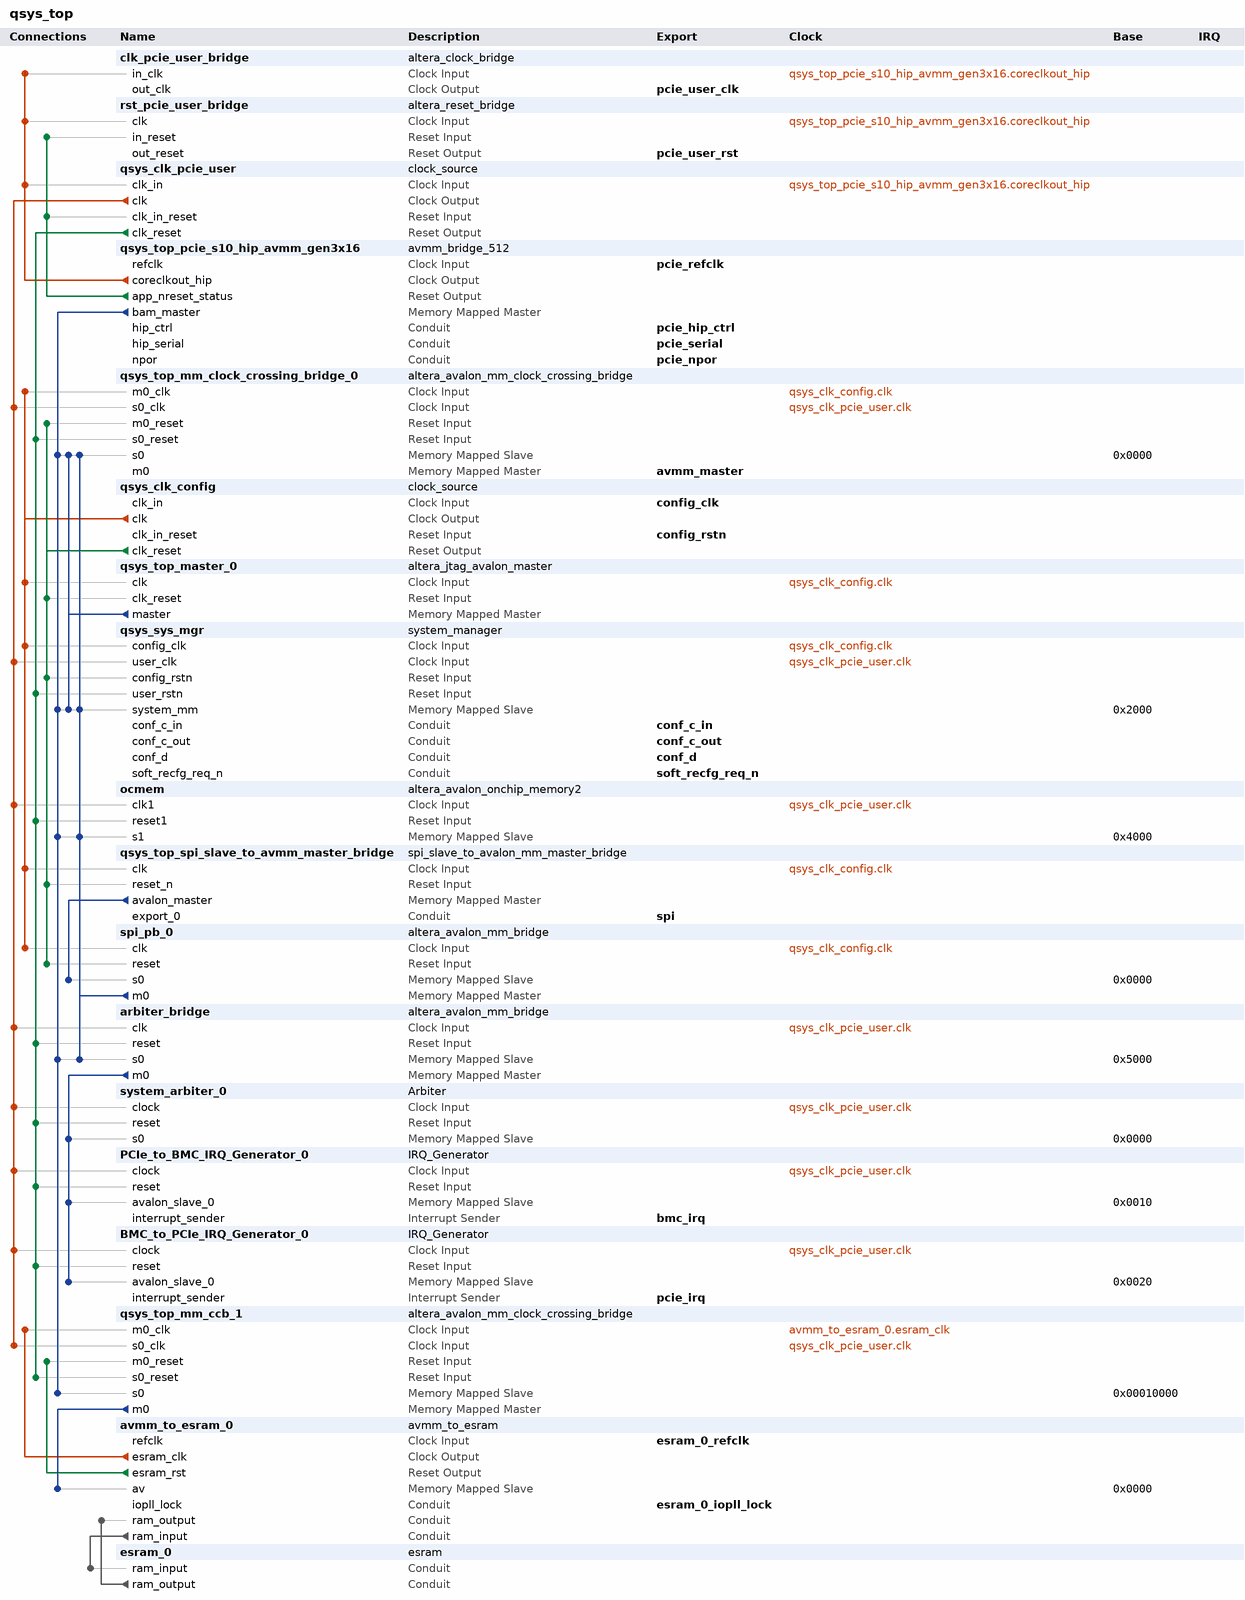
[diagram p0: system contents]
# Platform Designer (Qsys) system qsys_top, Stratix 10 1SM21CHU2F53E2VG
# Parameters at their usual value, and those the tool derives, are not listed.
package require -exact qsys 1.0
create_system qsys_top
set_project_property DEVICE_FAMILY {Stratix 10}
set_project_property DEVICE 1SM21CHU2F53E2VG

add_component clk_pcie_user_bridge ip/qsys_top/qsys_top_clock_bridge_0.ip altera_clock_bridge clk_pcie_user_bridge 19.2.0
load_component clk_pcie_user_bridge
set_component_parameter_value DERIVED_CLOCK_RATE 125000000
set_component_parameter_value EXPLICIT_CLOCK_RATE 250000000
save_component

add_component rst_pcie_user_bridge ip/qsys_top/rst_pcie_user_bridge.ip altera_reset_bridge rst_pcie_user_bridge 19.2.0
load_component rst_pcie_user_bridge
set_component_parameter_value ACTIVE_LOW_RESET 0
set_component_parameter_value SYNCHRONOUS_EDGES deassert
set_component_parameter_value SYNC_RESET 0
save_component

add_component qsys_clk_pcie_user ip/qsys_top/qsys_top_clk_0.ip clock_source qsys_clk_pcie_user 
load_component qsys_clk_pcie_user
set_component_parameter_value clockFrequency 250000000
save_component

add_component qsys_top_pcie_s10_hip_avmm_gen3x16 ip/qsys_top/qsys_top_avmm_bridge_512_0.ip avmm_bridge_512 qsys_top_pcie_s10_hip_avmm_gen3x16 21.0.0
load_component qsys_top_pcie_s10_hip_avmm_gen3x16
set_component_parameter_value interface_type_hwtcl Avalon-MM
set_component_parameter_value interface_type_integer_hwtcl 1
set_component_parameter_value device_die_types HSSI_CRETE2E,MAIN_ND4H,UIB_HBM
set_component_parameter_value device_die_revisions HSSI_CRETE2E_REVB,MAIN_ND4H_REVB,UIB_HBM_REVB
set_component_parameter_value crete_type 3
set_component_parameter_value app_interface_width_hwtcl 512-bit
set_component_parameter_value wrala_hwtcl {Gen3x16, Interface - 512 bit, 250 MHz}
set_component_parameter_value wrala_integer_hwtcl 1
set_component_parameter_value select_design_example_hwtcl PIO
set_component_parameter_value virtual_rp_ep_mode_hwtcl {Native Endpoint}
set_component_parameter_value virtual_rp_ep_mode_integer_hwtcl 0
set_component_parameter_value virtual_ep_native_hwtcl Native
set_component_parameter_value virtual_link_width_hwtcl x16
set_component_parameter_value virtual_link_width_integer_hwtcl 16
set_component_parameter_value virtual_link_rate_hwtcl {Gen3 (8.0 Gbps)}
set_component_parameter_value virtual_link_rate_integer_hwtcl 3
set_component_parameter_value virtual_txeq_mode_hwtcl gen3_cr2
set_component_parameter_value enable_512adapter_hwtcl 1
set_component_parameter_value enable_pcie_cv_fix 0
set_component_parameter_value enable_rx_buffer_limit_ports_hwtcl 1
set_component_parameter_value rx_np_buffer_limit_bypass_hwtcl 0
set_component_parameter_value rx_p_buffer_limit_bypass_hwtcl 0
set_component_parameter_value rx_cpl_buffer_limit_bypass_hwtcl 0
set_component_parameter_value en_order_rx_posted_cpl_hwtcl 1
set_component_parameter_value enable_multi_func_hwtcl 0
set_component_parameter_value total_pf_count_hwtcl 1
set_component_parameter_value user_total_pf_count_hwtcl 1
set_component_parameter_value total_pf_count_width_hwtcl 1
set_component_parameter_value virtual_pf1_enable_hwtcl 0
set_component_parameter_value virtual_pf2_enable_hwtcl 0
set_component_parameter_value virtual_pf3_enable_hwtcl 0
set_component_parameter_value enable_sriov_hwtcl 0
set_component_parameter_value virtual_pf1_sriov_enable_hwtcl 0
set_component_parameter_value virtual_pf2_sriov_enable_hwtcl 0
set_component_parameter_value virtual_pf3_sriov_enable_hwtcl 0
set_component_parameter_value pf0_vf_count_hwtcl 0
set_component_parameter_value pf0_sriov_sup_page_size_hwtcl 0KB
set_component_parameter_value pf0_loopback_enable_hwtcl 0
set_component_parameter_value pf1_vf_count_hwtcl 0
set_component_parameter_value pf1_sriov_sup_page_size_hwtcl 0KB
set_component_parameter_value pf2_vf_count_hwtcl 0
set_component_parameter_value pf2_sriov_sup_page_size_hwtcl 0KB
set_component_parameter_value pf3_vf_count_hwtcl 0
set_component_parameter_value pf3_sriov_sup_page_size_hwtcl 0KB
set_component_parameter_value total_vf_count_hwtcl 0
set_component_parameter_value total_vf_count_width_hwtcl 1
set_component_parameter_value pf0_bar0_type_user_hwtcl {64-bit prefetchable memory}
set_component_parameter_value pf0_bar0_address_width_user_hwtcl 20
set_component_parameter_value pf0_bar0_type_hwtcl {64-bit prefetchable memory}
set_component_parameter_value pf0_bar0_type_integer_hwtcl 1
set_component_parameter_value pf0_bar0_address_width_hwtcl 20
set_component_parameter_value pf0_bar1_type_user_hwtcl Disabled
set_component_parameter_value pf0_bar1_address_width_user_hwtcl 0
set_component_parameter_value pf0_bar1_type_hwtcl Disabled
set_component_parameter_value pf0_bar1_type_integer_hwtcl 0
set_component_parameter_value pf0_bar1_address_width_hwtcl 0
set_component_parameter_value pf0_bar2_type_user_hwtcl Disabled
set_component_parameter_value pf0_bar2_address_width_user_hwtcl 0
set_component_parameter_value pf0_bar2_type_hwtcl Disabled
set_component_parameter_value pf0_bar2_type_integer_hwtcl 0
set_component_parameter_value pf0_bar2_address_width_hwtcl 0
set_component_parameter_value pf0_bar3_type_user_hwtcl Disabled
set_component_parameter_value pf0_bar3_address_width_user_hwtcl 0
set_component_parameter_value pf0_bar3_type_hwtcl Disabled
set_component_parameter_value pf0_bar3_type_integer_hwtcl 0
set_component_parameter_value pf0_bar3_address_width_hwtcl 0
set_component_parameter_value pf0_bar4_type_user_hwtcl Disabled
set_component_parameter_value pf0_bar4_address_width_user_hwtcl 0
set_component_parameter_value pf0_bar4_type_hwtcl Disabled
set_component_parameter_value pf0_bar4_type_integer_hwtcl 0
set_component_parameter_value pf0_bar4_address_width_hwtcl 0
set_component_parameter_value pf0_bar5_type_user_hwtcl Disabled
set_component_parameter_value pf0_bar5_address_width_user_hwtcl 0
set_component_parameter_value pf0_bar5_type_hwtcl Disabled
set_component_parameter_value pf0_bar5_type_integer_hwtcl 0
set_component_parameter_value pf0_bar5_address_width_hwtcl 0
set_component_parameter_value pf0_rom_bar_enabled_hwtcl disable
set_component_parameter_value pf0_expansion_base_address_register_hwtcl 0
set_component_parameter_value pf0_sriov_vf_bar0_type_hwtcl Disabled
set_component_parameter_value pf0_sriov_vf_bar0_type_integer_hwtcl 0
set_component_parameter_value pf0_sriov_vf_bar0_address_width_hwtcl 0
set_component_parameter_value pf0_sriov_vf_bar1_type_hwtcl Disabled
set_component_parameter_value pf0_sriov_vf_bar1_type_integer_hwtcl 0
set_component_parameter_value pf0_sriov_vf_bar1_address_width_hwtcl 0
set_component_parameter_value pf0_sriov_vf_bar2_type_hwtcl Disabled
set_component_parameter_value pf0_sriov_vf_bar2_type_integer_hwtcl 0
set_component_parameter_value pf0_sriov_vf_bar2_address_width_hwtcl 0
set_component_parameter_value pf0_sriov_vf_bar3_type_hwtcl Disabled
set_component_parameter_value pf0_sriov_vf_bar3_type_integer_hwtcl 0
set_component_parameter_value pf0_sriov_vf_bar3_address_width_hwtcl 0
set_component_parameter_value pf0_sriov_vf_bar4_type_hwtcl Disabled
set_component_parameter_value pf0_sriov_vf_bar4_type_integer_hwtcl 0
set_component_parameter_value pf0_sriov_vf_bar4_address_width_hwtcl 0
set_component_parameter_value pf0_sriov_vf_bar5_type_hwtcl Disabled
set_component_parameter_value pf0_sriov_vf_bar5_type_integer_hwtcl 0
set_component_parameter_value pf0_sriov_vf_bar5_address_width_hwtcl 0
set_component_parameter_value pf1_bar0_type_user_hwtcl Disabled
set_component_parameter_value pf1_bar0_address_width_user_hwtcl 0
set_component_parameter_value pf1_bar0_type_hwtcl Disabled
set_component_parameter_value pf1_bar0_type_integer_hwtcl 0
set_component_parameter_value pf1_bar0_address_width_hwtcl 0
set_component_parameter_value pf1_bar1_type_user_hwtcl Disabled
set_component_parameter_value pf1_bar1_address_width_user_hwtcl 0
set_component_parameter_value pf1_bar1_type_hwtcl Disabled
set_component_parameter_value pf1_bar1_type_integer_hwtcl 0
set_component_parameter_value pf1_bar1_address_width_hwtcl 0
set_component_parameter_value pf1_bar2_type_user_hwtcl Disabled
set_component_parameter_value pf1_bar2_address_width_user_hwtcl 0
set_component_parameter_value pf1_bar2_type_hwtcl Disabled
set_component_parameter_value pf1_bar2_type_integer_hwtcl 0
set_component_parameter_value pf1_bar2_address_width_hwtcl 0
set_component_parameter_value pf1_bar3_type_user_hwtcl Disabled
set_component_parameter_value pf1_bar3_address_width_user_hwtcl 0
set_component_parameter_value pf1_bar3_type_hwtcl Disabled
set_component_parameter_value pf1_bar3_type_integer_hwtcl 0
set_component_parameter_value pf1_bar3_address_width_hwtcl 0
set_component_parameter_value pf1_bar4_type_user_hwtcl Disabled
set_component_parameter_value pf1_bar4_address_width_user_hwtcl 0
set_component_parameter_value pf1_bar4_type_hwtcl Disabled
set_component_parameter_value pf1_bar4_type_integer_hwtcl 0
set_component_parameter_value pf1_bar4_address_width_hwtcl 0
set_component_parameter_value pf1_bar5_type_user_hwtcl Disabled
set_component_parameter_value pf1_bar5_address_width_user_hwtcl 0
set_component_parameter_value pf1_bar5_type_hwtcl Disabled
set_component_parameter_value pf1_bar5_type_integer_hwtcl 0
set_component_parameter_value pf1_bar5_address_width_hwtcl 0
set_component_parameter_value pf1_rom_bar_enabled_hwtcl disable
set_component_parameter_value pf1_expansion_base_address_register_hwtcl 0
set_component_parameter_value pf1_sriov_vf_bar0_type_hwtcl Disabled
set_component_parameter_value pf1_sriov_vf_bar0_type_integer_hwtcl 0
set_component_parameter_value pf1_sriov_vf_bar0_address_width_hwtcl 0
set_component_parameter_value pf1_sriov_vf_bar1_type_hwtcl Disabled
set_component_parameter_value pf1_sriov_vf_bar1_type_integer_hwtcl 0
set_component_parameter_value pf1_sriov_vf_bar1_address_width_hwtcl 0
set_component_parameter_value pf1_sriov_vf_bar2_type_hwtcl Disabled
set_component_parameter_value pf1_sriov_vf_bar2_type_integer_hwtcl 0
set_component_parameter_value pf1_sriov_vf_bar2_address_width_hwtcl 0
set_component_parameter_value pf1_sriov_vf_bar3_type_hwtcl Disabled
set_component_parameter_value pf1_sriov_vf_bar3_type_integer_hwtcl 0
set_component_parameter_value pf1_sriov_vf_bar3_address_width_hwtcl 0
set_component_parameter_value pf1_sriov_vf_bar4_type_hwtcl Disabled
set_component_parameter_value pf1_sriov_vf_bar4_type_integer_hwtcl 0
set_component_parameter_value pf1_sriov_vf_bar4_address_width_hwtcl 0
set_component_parameter_value pf1_sriov_vf_bar5_type_hwtcl Disabled
set_component_parameter_value pf1_sriov_vf_bar5_type_integer_hwtcl 0
set_component_parameter_value pf1_sriov_vf_bar5_address_width_hwtcl 0
set_component_parameter_value pf2_bar0_type_user_hwtcl Disabled
set_component_parameter_value pf2_bar0_address_width_user_hwtcl 0
set_component_parameter_value pf2_bar0_type_hwtcl Disabled
set_component_parameter_value pf2_bar0_type_integer_hwtcl 0
set_component_parameter_value pf2_bar0_address_width_hwtcl 0
set_component_parameter_value pf2_bar1_type_user_hwtcl Disabled
set_component_parameter_value pf2_bar1_address_width_user_hwtcl 0
set_component_parameter_value pf2_bar1_type_hwtcl Disabled
set_component_parameter_value pf2_bar1_type_integer_hwtcl 0
set_component_parameter_value pf2_bar1_address_width_hwtcl 0
set_component_parameter_value pf2_bar2_type_user_hwtcl Disabled
set_component_parameter_value pf2_bar2_address_width_user_hwtcl 0
set_component_parameter_value pf2_bar2_type_hwtcl Disabled
set_component_parameter_value pf2_bar2_type_integer_hwtcl 0
set_component_parameter_value pf2_bar2_address_width_hwtcl 0
set_component_parameter_value pf2_bar3_type_user_hwtcl Disabled
set_component_parameter_value pf2_bar3_address_width_user_hwtcl 0
set_component_parameter_value pf2_bar3_type_hwtcl Disabled
set_component_parameter_value pf2_bar3_type_integer_hwtcl 0
set_component_parameter_value pf2_bar3_address_width_hwtcl 0
set_component_parameter_value pf2_bar4_type_user_hwtcl Disabled
set_component_parameter_value pf2_bar4_address_width_user_hwtcl 0
set_component_parameter_value pf2_bar4_type_hwtcl Disabled
set_component_parameter_value pf2_bar4_type_integer_hwtcl 0
set_component_parameter_value pf2_bar4_address_width_hwtcl 0
set_component_parameter_value pf2_bar5_type_user_hwtcl Disabled
set_component_parameter_value pf2_bar5_address_width_user_hwtcl 0
set_component_parameter_value pf2_bar5_type_hwtcl Disabled
set_component_parameter_value pf2_bar5_type_integer_hwtcl 0
set_component_parameter_value pf2_bar5_address_width_hwtcl 0
set_component_parameter_value pf2_rom_bar_enabled_hwtcl disable
set_component_parameter_value pf2_expansion_base_address_register_hwtcl 0
set_component_parameter_value pf2_sriov_vf_bar0_type_hwtcl Disabled
set_component_parameter_value pf2_sriov_vf_bar0_type_integer_hwtcl 0
set_component_parameter_value pf2_sriov_vf_bar0_address_width_hwtcl 0
set_component_parameter_value pf2_sriov_vf_bar1_type_hwtcl Disabled
set_component_parameter_value pf2_sriov_vf_bar1_type_integer_hwtcl 0
set_component_parameter_value pf2_sriov_vf_bar1_address_width_hwtcl 0
set_component_parameter_value pf2_sriov_vf_bar2_type_hwtcl Disabled
set_component_parameter_value pf2_sriov_vf_bar2_type_integer_hwtcl 0
set_component_parameter_value pf2_sriov_vf_bar2_address_width_hwtcl 0
set_component_parameter_value pf2_sriov_vf_bar3_type_hwtcl Disabled
set_component_parameter_value pf2_sriov_vf_bar3_type_integer_hwtcl 0
set_component_parameter_value pf2_sriov_vf_bar3_address_width_hwtcl 0
set_component_parameter_value pf2_sriov_vf_bar4_type_hwtcl Disabled
set_component_parameter_value pf2_sriov_vf_bar4_type_integer_hwtcl 0
set_component_parameter_value pf2_sriov_vf_bar4_address_width_hwtcl 0
set_component_parameter_value pf2_sriov_vf_bar5_type_hwtcl Disabled
set_component_parameter_value pf2_sriov_vf_bar5_type_integer_hwtcl 0
set_component_parameter_value pf2_sriov_vf_bar5_address_width_hwtcl 0
set_component_parameter_value pf3_bar0_type_user_hwtcl Disabled
set_component_parameter_value pf3_bar0_address_width_user_hwtcl 0
set_component_parameter_value pf3_bar0_type_hwtcl Disabled
set_component_parameter_value pf3_bar0_type_integer_hwtcl 0
set_component_parameter_value pf3_bar0_address_width_hwtcl 0
set_component_parameter_value pf3_bar1_type_user_hwtcl Disabled
set_component_parameter_value pf3_bar1_address_width_user_hwtcl 0
set_component_parameter_value pf3_bar1_type_hwtcl Disabled
set_component_parameter_value pf3_bar1_type_integer_hwtcl 0
set_component_parameter_value pf3_bar1_address_width_hwtcl 0
set_component_parameter_value pf3_bar2_type_user_hwtcl Disabled
set_component_parameter_value pf3_bar2_address_width_user_hwtcl 0
set_component_parameter_value pf3_bar2_type_hwtcl Disabled
set_component_parameter_value pf3_bar2_type_integer_hwtcl 0
set_component_parameter_value pf3_bar2_address_width_hwtcl 0
set_component_parameter_value pf3_bar3_type_user_hwtcl Disabled
set_component_parameter_value pf3_bar3_address_width_user_hwtcl 0
set_component_parameter_value pf3_bar3_type_hwtcl Disabled
set_component_parameter_value pf3_bar3_type_integer_hwtcl 0
set_component_parameter_value pf3_bar3_address_width_hwtcl 0
set_component_parameter_value pf3_bar4_type_user_hwtcl Disabled
set_component_parameter_value pf3_bar4_address_width_user_hwtcl 0
set_component_parameter_value pf3_bar4_type_hwtcl Disabled
set_component_parameter_value pf3_bar4_type_integer_hwtcl 0
set_component_parameter_value pf3_bar4_address_width_hwtcl 0
set_component_parameter_value pf3_bar5_type_user_hwtcl Disabled
set_component_parameter_value pf3_bar5_address_width_user_hwtcl 0
set_component_parameter_value pf3_bar5_type_hwtcl Disabled
set_component_parameter_value pf3_bar5_type_integer_hwtcl 0
set_component_parameter_value pf3_bar5_address_width_hwtcl 0
set_component_parameter_value pf3_rom_bar_enabled_hwtcl disable
set_component_parameter_value pf3_expansion_base_address_register_hwtcl 0
set_component_parameter_value pf3_sriov_vf_bar0_type_hwtcl Disabled
set_component_parameter_value pf3_sriov_vf_bar0_type_integer_hwtcl 0
set_component_parameter_value pf3_sriov_vf_bar0_address_width_hwtcl 0
set_component_parameter_value pf3_sriov_vf_bar1_type_hwtcl Disabled
set_component_parameter_value pf3_sriov_vf_bar1_type_integer_hwtcl 0
set_component_parameter_value pf3_sriov_vf_bar1_address_width_hwtcl 0
set_component_parameter_value pf3_sriov_vf_bar2_type_hwtcl Disabled
set_component_parameter_value pf3_sriov_vf_bar2_type_integer_hwtcl 0
set_component_parameter_value pf3_sriov_vf_bar2_address_width_hwtcl 0
set_component_parameter_value pf3_sriov_vf_bar3_type_hwtcl Disabled
set_component_parameter_value pf3_sriov_vf_bar3_type_integer_hwtcl 0
set_component_parameter_value pf3_sriov_vf_bar3_address_width_hwtcl 0
set_component_parameter_value pf3_sriov_vf_bar4_type_hwtcl Disabled
set_component_parameter_value pf3_sriov_vf_bar4_type_integer_hwtcl 0
set_component_parameter_value pf3_sriov_vf_bar4_address_width_hwtcl 0
set_component_parameter_value pf3_sriov_vf_bar5_type_hwtcl Disabled
set_component_parameter_value pf3_sriov_vf_bar5_type_integer_hwtcl 0
set_component_parameter_value pf3_sriov_vf_bar5_address_width_hwtcl 0
set_component_parameter_value pf0_sriov_vf_offset_ari_cs2_hwtcl 0
set_component_parameter_value pf1_sriov_vf_offset_ari_cs2_hwtcl 0
set_component_parameter_value pf2_sriov_vf_offset_ari_cs2_hwtcl 0
set_component_parameter_value pf3_sriov_vf_offset_ari_cs2_hwtcl 0
set_component_parameter_value pf0_sriov_vf_offset_position_nonari_hwtcl 0
set_component_parameter_value pf1_sriov_vf_offset_position_nonari_hwtcl 0
set_component_parameter_value pf2_sriov_vf_offset_position_nonari_hwtcl 0
set_component_parameter_value pf3_sriov_vf_offset_position_nonari_hwtcl 0
set_component_parameter_value pf0_shadow_sriov_vf_stride_ari_cs2_hwtcl 0
set_component_parameter_value pf1_shadow_sriov_vf_stride_ari_cs2_hwtcl 0
set_component_parameter_value pf2_shadow_sriov_vf_stride_ari_cs2_hwtcl 0
set_component_parameter_value pf3_shadow_sriov_vf_stride_ari_cs2_hwtcl 0
set_component_parameter_value pf0_sriov_vf_stride_nonari_hwtcl 0
set_component_parameter_value pf1_sriov_vf_stride_nonari_hwtcl 0
set_component_parameter_value pf2_sriov_vf_stride_nonari_hwtcl 0
set_component_parameter_value pf3_sriov_vf_stride_nonari_hwtcl 0
set_component_parameter_value enable_read_mover_hwtcl 0
set_component_parameter_value read_mover_address_width_hwtcl 64
set_component_parameter_value enable_write_mover_hwtcl 0
set_component_parameter_value write_mover_address_width_hwtcl 64
set_component_parameter_value enable_root_port_hwtcl 0
set_component_parameter_value enable_advanced_interrupt_hwtcl 0
set_component_parameter_value enable_bursting_slave_hwtcl 0
set_component_parameter_value bursting_slave_address_width_hwtcl 64
set_component_parameter_value enable_bursting_master_hwtcl 1
set_component_parameter_value user_bursting_master_address_width_hwtcl 64
set_component_parameter_value bursting_master_address_width_hwtcl 20
set_component_parameter_value enable_legacy_interrupt_hwtcl 0
set_component_parameter_value pfnum_width_hwtcl 2
set_component_parameter_value vfnum_width_hwtcl 11
set_component_parameter_value virtual_maxpayload_size_hwtcl 128
set_component_parameter_value pf0_pcie_cap_ext_tag_supp_user_hwtcl 1
set_component_parameter_value pf0_pcie_cap_ext_tag_supp_hwtcl 1
set_component_parameter_value pf1_pcie_cap_ext_tag_supp_hwtcl 0
set_component_parameter_value pf2_pcie_cap_ext_tag_supp_hwtcl 0
set_component_parameter_value pf3_pcie_cap_ext_tag_supp_hwtcl 0
set_component_parameter_value pf0_pcie_cap_flr_cap_user_hwtcl 1
set_component_parameter_value pf0_pcie_cap_flr_cap_hwtcl 1
set_component_parameter_value pf1_pcie_cap_flr_cap_hwtcl 0
set_component_parameter_value pf3_pcie_cap_flr_cap_hwtcl 0
set_component_parameter_value pf2_pcie_cap_flr_cap_hwtcl 0
set_component_parameter_value pf0_pcie_cap_port_num_hwtcl 1
set_component_parameter_value pf0_pcie_cap_slot_clk_config_hwtcl 1
set_component_parameter_value virtual_pf0_msi_enable_user_hwtcl 1
set_component_parameter_value virtual_pf1_msi_enable_user_hwtcl 0
set_component_parameter_value virtual_pf2_msi_enable_user_hwtcl 0
set_component_parameter_value virtual_pf3_msi_enable_user_hwtcl 0
set_component_parameter_value virtual_pf0_msi_enable_hwtcl 1
set_component_parameter_value virtual_pf1_msi_enable_hwtcl 0
set_component_parameter_value virtual_pf2_msi_enable_hwtcl 0
set_component_parameter_value virtual_pf3_msi_enable_hwtcl 0
set_component_parameter_value pf0_pci_msi_multiple_msg_cap_hwtcl 4
set_component_parameter_value pf1_pci_msi_multiple_msg_cap_hwtcl 1
set_component_parameter_value pf2_pci_msi_multiple_msg_cap_hwtcl 1
set_component_parameter_value pf3_pci_msi_multiple_msg_cap_hwtcl 1
set_component_parameter_value virtual_pf0_msix_enable_hwtcl 0
set_component_parameter_value pf0_pci_msix_table_size_hwtcl 0
set_component_parameter_value pf0_pci_msix_table_offset_hwtcl 0
set_component_parameter_value pf0_pci_msix_bir_hwtcl 0
set_component_parameter_value pf0_pci_msix_pba_offset_hwtcl 0
set_component_parameter_value pf0_pci_msix_pba_hwtcl 0
set_component_parameter_value virtual_pf1_msix_enable_hwtcl 0
set_component_parameter_value pf1_pci_msix_table_size_hwtcl 0
set_component_parameter_value pf1_pci_msix_table_offset_hwtcl 0
set_component_parameter_value pf1_pci_msix_bir_hwtcl 0
set_component_parameter_value pf1_pci_msix_pba_offset_hwtcl 0
set_component_parameter_value pf1_pci_msix_pba_hwtcl 0
set_component_parameter_value virtual_pf2_msix_enable_hwtcl 0
set_component_parameter_value pf2_pci_msix_table_size_hwtcl 0
set_component_parameter_value pf2_pci_msix_table_offset_hwtcl 0
set_component_parameter_value pf2_pci_msix_bir_hwtcl 0
set_component_parameter_value pf2_pci_msix_pba_offset_hwtcl 0
set_component_parameter_value pf2_pci_msix_pba_hwtcl 0
set_component_parameter_value virtual_pf3_msix_enable_hwtcl 0
set_component_parameter_value pf3_pci_msix_table_size_hwtcl 0
set_component_parameter_value pf3_pci_msix_table_offset_hwtcl 0
set_component_parameter_value pf3_pci_msix_bir_hwtcl 0
set_component_parameter_value pf3_pci_msix_pba_offset_hwtcl 0
set_component_parameter_value pf3_pci_msix_pba_hwtcl 0
set_component_parameter_value pf0_pcie_slot_imp_hwtcl 0
set_component_parameter_value pf0_pcie_cap_slot_power_limit_value_hwtcl 0
set_component_parameter_value pf0_pcie_cap_slot_power_limit_scale_hwtcl 0
set_component_parameter_value pf0_pcie_cap_phy_slot_num_hwtcl 0
set_component_parameter_value pf0_pcie_cap_ep_l0s_accpt_latency_hwtcl 0
set_component_parameter_value pf0_pcie_cap_ep_l1_accpt_latency_hwtcl 0
set_component_parameter_value cvp_user_id_hwtcl 0
set_component_parameter_value hip_reconfig_hwtcl 0
set_component_parameter_value xcvr_reconfig_hwtcl 0
set_component_parameter_value xcvr_adme_hwtcl 0
set_component_parameter_value pcie_link_inspector_hwtcl 0
set_component_parameter_value pcie_link_inspector_avmm_hwtcl 0
set_component_parameter_value pf0_pcie_cap_sel_deemphasis_hwtcl 6dB
set_component_parameter_value anlg_voltage 1_1V
set_component_parameter_value virtual_phase23_txpreset_hwtcl {Preset 8}
set_component_parameter_value ceb_extend_pcie_hwtcl 0
set_component_parameter_value enable_hip_status_for_avmm_hwtcl 0
set_component_parameter_value pf0_pci_type0_vendor_id_hwtcl 6538
set_component_parameter_value pf0_pci_type0_device_id_hwtcl 1313
set_component_parameter_value pf0_revision_id_hwtcl 1
set_component_parameter_value pf0_class_code_hwtcl 0
set_component_parameter_value pf0_base_class_code_hwtcl 0
set_component_parameter_value pf0_subclass_code_hwtcl 0
set_component_parameter_value pf0_program_interface_hwtcl 0
set_component_parameter_value pf0_subsys_vendor_id_hwtcl 0
set_component_parameter_value pf0_subsys_dev_id_hwtcl 0
set_component_parameter_value pf1_pci_type0_vendor_id_hwtcl 0
set_component_parameter_value pf1_pci_type0_device_id_hwtcl 0
set_component_parameter_value pf1_revision_id_hwtcl 0
set_component_parameter_value pf1_class_code_hwtcl 0
set_component_parameter_value pf1_base_class_code_hwtcl 0
set_component_parameter_value pf1_subclass_code_hwtcl 0
set_component_parameter_value pf1_program_interface_hwtcl 0
set_component_parameter_value pf1_subsys_vendor_id_hwtcl 0
set_component_parameter_value pf1_subsys_dev_id_hwtcl 0
set_component_parameter_value pf2_pci_type0_vendor_id_hwtcl 0
set_component_parameter_value pf2_pci_type0_device_id_hwtcl 0
set_component_parameter_value pf2_revision_id_hwtcl 0
set_component_parameter_value pf2_class_code_hwtcl 0
set_component_parameter_value pf2_base_class_code_hwtcl 0
set_component_parameter_value pf2_subclass_code_hwtcl 0
set_component_parameter_value pf2_program_interface_hwtcl 0
set_component_parameter_value pf2_subsys_vendor_id_hwtcl 0
set_component_parameter_value pf2_subsys_dev_id_hwtcl 0
set_component_parameter_value pf3_pci_type0_vendor_id_hwtcl 0
set_component_parameter_value pf3_pci_type0_device_id_hwtcl 0
set_component_parameter_value pf3_revision_id_hwtcl 0
set_component_parameter_value pf3_class_code_hwtcl 0
set_component_parameter_value pf3_base_class_code_hwtcl 0
set_component_parameter_value pf3_subclass_code_hwtcl 0
set_component_parameter_value pf3_program_interface_hwtcl 0
set_component_parameter_value pf3_subsys_vendor_id_hwtcl 0
set_component_parameter_value pf3_subsys_dev_id_hwtcl 0
set_component_parameter_value pll_refclk_freq_hwtcl {100 MHz}
set_component_parameter_value data_width_integer_hwtcl 512
set_component_parameter_value pld_clk_mhz_integer_hwtcl 125
set_component_parameter_value apps_type_hwtcl 0
set_component_parameter_value bfm_drive_interface_clk_hwtcl 1
set_component_parameter_value bfm_drive_interface_npor_hwtcl 1
set_component_parameter_value bfm_drive_interface_pipe_hwtcl 1
set_component_parameter_value bfm_drive_interface_control_hwtcl 1
set_component_parameter_value serial_sim_hwtcl 1
set_component_parameter_value enable_pipe32_phyip_ser_driver_hwtcl 0
set_component_parameter_value use_rpbfm_pro 0
set_component_parameter_value use_pll_lock_hwtcl 1
set_component_parameter_value enable_test_out_hwtcl 0
set_component_parameter_value enable_pld_warm_rst_rdy_hwtcl 0
set_component_parameter_value enable_avst_deskew_hwtcl 1
set_component_parameter_value enable_completion_checking_hwtcl 0
set_component_parameter_value virtual_pf0_ats_cap_enable_hwtcl 0
set_component_parameter_value virtual_pf1_ats_cap_enable_hwtcl 0
set_component_parameter_value virtual_pf2_ats_cap_enable_hwtcl 0
set_component_parameter_value virtual_pf3_ats_cap_enable_hwtcl 0
set_component_parameter_value pf0_vf_ats_cap_enable_hwtcl 0
set_component_parameter_value pf1_vf_ats_cap_enable_hwtcl 0
set_component_parameter_value pf2_vf_ats_cap_enable_hwtcl 0
set_component_parameter_value pf3_vf_ats_cap_enable_hwtcl 0
set_component_parameter_value virtual_pf0_tph_cap_enable_hwtcl 0
set_component_parameter_value virtual_pf1_tph_cap_enable_hwtcl 0
set_component_parameter_value virtual_pf2_tph_cap_enable_hwtcl 0
set_component_parameter_value virtual_pf3_tph_cap_enable_hwtcl 0
set_component_parameter_value pf0_vf_tph_cap_enable_hwtcl 0
set_component_parameter_value pf1_vf_tph_cap_enable_hwtcl 0
set_component_parameter_value pf2_vf_tph_cap_enable_hwtcl 0
set_component_parameter_value pf3_vf_tph_cap_enable_hwtcl 0
set_component_parameter_value pf0_tph_st_int_mode_hwtcl 0
set_component_parameter_value pf0_vf_tph_st_int_mode_hwtcl 0
set_component_parameter_value pf0_tph_st_dev_spec_mode_hwtcl 0
set_component_parameter_value pf0_vf_tph_st_dev_spec_mode_hwtcl 0
set_component_parameter_value pf0_tph_req_cap_st_table_loc_1_hwtcl {ST table not present}
set_component_parameter_value pf0_tph_req_cap_st_table_loc_1_vfcomm_cs2_hwtcl {ST table not present}
set_component_parameter_value pf0_tph_req_cap_st_table_size_hwtcl 0
set_component_parameter_value pf0_tph_req_cap_st_table_size_vfcomm_cs2_hwtcl 0
set_component_parameter_value pf1_tph_st_int_mode_hwtcl 0
set_component_parameter_value pf1_vf_tph_st_int_mode_hwtcl 0
set_component_parameter_value pf1_tph_st_dev_spec_mode_hwtcl 0
set_component_parameter_value pf1_vf_tph_st_dev_spec_mode_hwtcl 0
set_component_parameter_value pf1_tph_req_cap_st_table_loc_1_hwtcl {ST table not present}
set_component_parameter_value pf1_tph_req_cap_st_table_loc_1_vfcomm_cs2_hwtcl {ST table not present}
set_component_parameter_value pf1_tph_req_cap_st_table_size_hwtcl 0
set_component_parameter_value pf1_tph_req_cap_st_table_size_vfcomm_cs2_hwtcl 0
set_component_parameter_value pf2_tph_st_int_mode_hwtcl 0
set_component_parameter_value pf2_vf_tph_st_int_mode_hwtcl 0
set_component_parameter_value pf2_tph_st_dev_spec_mode_hwtcl 0
set_component_parameter_value pf2_vf_tph_st_dev_spec_mode_hwtcl 0
set_component_parameter_value pf2_tph_req_cap_st_table_loc_1_hwtcl {ST table not present}
set_component_parameter_value pf2_tph_req_cap_st_table_loc_1_vfcomm_cs2_hwtcl {ST table not present}
set_component_parameter_value pf2_tph_req_cap_st_table_size_hwtcl 0
set_component_parameter_value pf2_tph_req_cap_st_table_size_vfcomm_cs2_hwtcl 0
set_component_parameter_value pf3_tph_st_int_mode_hwtcl 0
set_component_parameter_value pf3_vf_tph_st_int_mode_hwtcl 0
set_component_parameter_value pf3_tph_st_dev_spec_mode_hwtcl 0
set_component_parameter_value pf3_vf_tph_st_dev_spec_mode_hwtcl 0
set_component_parameter_value pf3_tph_req_cap_st_table_loc_1_hwtcl {ST table not present}
set_component_parameter_value pf3_tph_req_cap_st_table_loc_1_vfcomm_cs2_hwtcl {ST table not present}
set_component_parameter_value pf3_tph_req_cap_st_table_size_hwtcl 0
set_component_parameter_value pf3_tph_req_cap_st_table_size_vfcomm_cs2_hwtcl 0
set_component_parameter_value cvp_jtag0 0
set_component_parameter_value cvp_jtag1 0
set_component_parameter_value cvp_jtag2 0
set_component_parameter_value cvp_jtag3 0
set_component_parameter_value pf0_cardbus_cis_pointer 0
set_component_parameter_value pf0_mask_radm_2 3
set_component_parameter_value pf0_sn_ser_num_reg_1_dw 0
set_component_parameter_value pf0_sn_ser_num_reg_2_dw 0
set_component_parameter_value pf0_sriov_sup_page_size 0
set_component_parameter_value pf0_sriov_vf_bar0_mask 0
set_component_parameter_value pf0_sriov_vf_bar1_mask 0
set_component_parameter_value pf0_sriov_vf_bar2_mask 0
set_component_parameter_value pf0_sriov_vf_bar3_mask 0
set_component_parameter_value pf0_sriov_vf_bar4_mask 0
set_component_parameter_value pf0_sriov_vf_bar5_mask 0
set_component_parameter_value pf1_cardbus_cis_pointer 0
set_component_parameter_value pf1_sn_ser_num_reg_1_dw 0
set_component_parameter_value pf1_sn_ser_num_reg_2_dw 0
set_component_parameter_value pf1_sriov_sup_page_size 0
set_component_parameter_value pf1_sriov_vf_bar0_mask 0
set_component_parameter_value pf1_sriov_vf_bar1_mask 0
set_component_parameter_value pf1_sriov_vf_bar2_mask 0
set_component_parameter_value pf1_sriov_vf_bar3_mask 0
set_component_parameter_value pf1_sriov_vf_bar4_mask 0
set_component_parameter_value pf1_sriov_vf_bar5_mask 0
set_component_parameter_value pf2_cardbus_cis_pointer 0
set_component_parameter_value pf2_sn_ser_num_reg_1_dw 0
set_component_parameter_value pf2_sn_ser_num_reg_2_dw 0
set_component_parameter_value pf2_sriov_sup_page_size 0
set_component_parameter_value pf3_cardbus_cis_pointer 0
set_component_parameter_value pf3_sn_ser_num_reg_1_dw 0
set_component_parameter_value pf3_sn_ser_num_reg_2_dw 0
set_component_parameter_value pf3_sriov_sup_page_size 0
set_component_parameter_value test_in_hi 0
set_component_parameter_value test_in_lo 0
set_component_parameter_value enable_dma_msix_table_hwtcl 0
set_component_parameter_value device_family {Stratix 10}
set_component_parameter_value base_device ND4H
set_component_parameter_value part_trait_device 1SM21CHU2F53E2VG
set_component_parameter_value design_environment QSYS
set_component_parameter_value enable_example_design_qii_hwtcl 1
set_component_parameter_value enable_example_design_sim_rp_hwtcl 0
set_component_parameter_value enable_example_design_sim_hwtcl 1
set_component_parameter_value select_example_design_sim_BFM_hwtcl {Intel FPGA BFM}
set_component_parameter_value enable_example_design_synth_hwtcl 1
set_component_parameter_value enable_example_design_synth_rp_hwtcl 0
set_component_parameter_value enable_example_design_tb_hwtcl 1
set_component_parameter_value select_design_example_rtl_lang_hwtcl Verilog
set_component_parameter_value targeted_devkit_hwtcl NONE
set_component_parameter_value chosen_devkit_hwtcl NONE
set_component_parameter_value chosen_devkit_opn_hwtcl 1SM21CHU2F53E2VG
set_component_parameter_value adp_bypass false
set_component_parameter_value aux_cfg_vf_en true
set_component_parameter_value aux_warm_reset_ctl true
set_component_parameter_value cfg_blk_crs_en false
set_component_parameter_value cfg_dbi_pf0_table_size 262
set_component_parameter_value cfg_dbi_pf1_start_addr 320
set_component_parameter_value cfg_dbi_pf1_tablesize 172
set_component_parameter_value cfg_g3_pset_coeff_0 64320
set_component_parameter_value cfg_g3_pset_coeff_1 44160
set_component_parameter_value cfg_g3_pset_coeff_10 84480
set_component_parameter_value cfg_g3_pset_coeff_2 52224
set_component_parameter_value cfg_g3_pset_coeff_3 36096
set_component_parameter_value cfg_g3_pset_coeff_4 3840
set_component_parameter_value cfg_g3_pset_coeff_5 3462
set_component_parameter_value cfg_g3_pset_coeff_6 3336
set_component_parameter_value cfg_g3_pset_coeff_7 51846
set_component_parameter_value cfg_g3_pset_coeff_8 35592
set_component_parameter_value cfg_g3_pset_coeff_9 3210
set_component_parameter_value cfg_vf_num_pf0 64
set_component_parameter_value cfg_vf_num_pf1 64
set_component_parameter_value cfg_vf_table_size 10
set_component_parameter_value clkmod_gen3_hclk_div_sel hclk_div2
set_component_parameter_value clkmod_gen3_hclk_source_sel hclk_1
set_component_parameter_value clkmod_hip_clk_dis false
set_component_parameter_value clkmod_pclk_sel pclk_ch7
set_component_parameter_value clkmod_pld_clk_out_sel div1
set_component_parameter_value clkmod_pld_clk_out_sel_2x aib2x_div1
set_component_parameter_value clock_ctl_rsvd_3 false
set_component_parameter_value clock_ctl_rsvd_5 false
set_component_parameter_value clrhip_not_rst_sticky false
set_component_parameter_value crs_override false
set_component_parameter_value crs_override_value true
set_component_parameter_value cvp_blocking_dis false
set_component_parameter_value cvp_clk_sel false
set_component_parameter_value cvp_data_compressed false
set_component_parameter_value cvp_data_encrypted false
set_component_parameter_value cvp_extra false
set_component_parameter_value cvp_hard_reset_bypass false
set_component_parameter_value cvp_hip_clk_sel_default false
set_component_parameter_value cvp_intf_reset_ctl 2
set_component_parameter_value cvp_irq_en false
set_component_parameter_value cvp_mode_default false
set_component_parameter_value cvp_mode_gating_dis false
set_component_parameter_value cvp_rate_sel false
set_component_parameter_value cvp_user_id 0
set_component_parameter_value cvp_vsec_id 4466
set_component_parameter_value cvp_vsec_rev 0
set_component_parameter_value cvp_warm_rst_ready_force_bit0 false
set_component_parameter_value cvp_warm_rst_ready_force_bit1 false
set_component_parameter_value cvp_warm_rst_req_ena disable
set_component_parameter_value cvp_write_mask_ctl 3
set_component_parameter_value device_type dev_nep
set_component_parameter_value ecc_chk_val true
set_component_parameter_value ecc_gen_val false
set_component_parameter_value eco_flops 0
set_component_parameter_value eqctrl_adp_ctle false
set_component_parameter_value eqctrl_ctle_val ctle_val_0
set_component_parameter_value eqctrl_dir_mode_en false
set_component_parameter_value eqctrl_fom_mode_en false
set_component_parameter_value eqctrl_legacy_mode_en false
set_component_parameter_value eqctrl_num_fom_cycles 0
set_component_parameter_value eqctrl_use_dsp_rxpreset false
set_component_parameter_value func_mode enable
set_component_parameter_value gpio_irq 0
set_component_parameter_value hip_pcs_chnl_en 65535
set_component_parameter_value hrc_chnl_cal_done_active chnl_cal_done_0_to_15
set_component_parameter_value hrc_chnl_en 65535
set_component_parameter_value hrc_chnl_txpll_master_cgb_rst_en 128
set_component_parameter_value hrc_chnl_txpll_rst_en 384
set_component_parameter_value hrc_en_pcs_fifo_err false
set_component_parameter_value hrc_force_inactive_rst false
set_component_parameter_value hrc_fref_clk_active fref_clk_sel_0
set_component_parameter_value hrc_mask_tx_pll_lock_active mask_tx_pll_lock_7
set_component_parameter_value hrc_pll_cal_done_active pll_cal_done_78
set_component_parameter_value hrc_pll_perst_en disable
set_component_parameter_value hrc_pma_perst_en level
set_component_parameter_value hrc_rstctl_1ms 0
set_component_parameter_value hrc_rstctl_1us 0
set_component_parameter_value hrc_rstctl_timer_type_a fref_cyc_a
set_component_parameter_value hrc_rstctl_timer_type_f fref_cyc_f
set_component_parameter_value hrc_rstctl_timer_type_g fref_cyc_g
set_component_parameter_value hrc_rstctl_timer_type_h fref_cyc_h
set_component_parameter_value hrc_rstctl_timer_type_i fref_cyc_i
set_component_parameter_value hrc_rstctl_timer_type_j fref_cyc_j
set_component_parameter_value hrc_rstctl_timer_value_a 10
set_component_parameter_value hrc_rstctl_timer_value_f 10
set_component_parameter_value hrc_rstctl_timer_value_g 2
set_component_parameter_value hrc_rstctl_timer_value_h 4
set_component_parameter_value hrc_rstctl_timer_value_i 20
set_component_parameter_value hrc_rstctl_timer_value_j 20
set_component_parameter_value hrc_rx_pcs_rst_n_active rx_pcs_rst_0_to_15
set_component_parameter_value hrc_rx_pll_lock_active rx_pll_lock_0_to_15
set_component_parameter_value hrc_rx_pma_rstb_active rx_pma_rstb_0_to_15
set_component_parameter_value hrc_soft_rstctrl_clr false
set_component_parameter_value hrc_soft_rstctrl_en disable
set_component_parameter_value hrc_tx_lc_pll_rstb_active tx_lc_pll_rstb_78
set_component_parameter_value hrc_tx_lcff_pll_lock_active tx_lcff_pll_lock_78
set_component_parameter_value hrc_tx_pcs_rst_n_active tx_pcs_rst_0_to_15
set_component_parameter_value irq_misc_ctrl 0
set_component_parameter_value k_phy_misc_ctrl_rsvd_0_5 32
set_component_parameter_value k_phy_misc_ctrl_rsvd_13_15 0
set_component_parameter_value pf0_ack_n_fts 255
set_component_parameter_value pf0_adv_err_int_msg_num 0
set_component_parameter_value pf0_aer_cap_aer_ext_cap_hdr_off_addr_byte2 258
set_component_parameter_value pf0_aer_cap_aer_ext_cap_hdr_off_addr_byte3 259
set_component_parameter_value pf0_aer_cap_root_err_status_off_addr_byte0 304
set_component_parameter_value pf0_aer_cap_version 2
set_component_parameter_value pf0_aer_next_offset 328
set_component_parameter_value pf0_ari_cap_ari_base_addr_byte2 378
set_component_parameter_value pf0_ari_cap_ari_base_addr_byte3 379
set_component_parameter_value pf0_ari_cap_version 1
set_component_parameter_value pf0_ari_next_offset 392
set_component_parameter_value pf0_ats_cap_ats_cap_hdr_reg_addr_byte2 646
set_component_parameter_value pf0_ats_cap_ats_cap_hdr_reg_addr_byte3 647
set_component_parameter_value pf0_ats_cap_ats_capabilities_ctrl_reg_addr_byte0 648
set_component_parameter_value pf0_ats_cap_version 1
set_component_parameter_value pf0_ats_capabilities_ctrl_reg_rsvdp_7 false
set_component_parameter_value pf0_ats_next_offset 0
set_component_parameter_value pf0_auto_lane_flip_ctrl_en disable
set_component_parameter_value pf0_aux_clk_freq 500
set_component_parameter_value pf0_aux_clk_freq_off_rsvdp_10 0
set_component_parameter_value pf0_aux_curr 0
set_component_parameter_value pf0_bar0_mem_io pf0_bar0_mem
set_component_parameter_value pf0_bar0_prefetch true
set_component_parameter_value pf0_bar0_start 0
set_component_parameter_value pf0_bar0_type pf0_bar0_mem64
set_component_parameter_value pf0_bar1_mem_io pf0_bar1_mem
set_component_parameter_value pf0_bar1_prefetch false
set_component_parameter_value pf0_bar1_start 0
set_component_parameter_value pf0_bar1_type pf0_bar1_mem32
set_component_parameter_value pf0_bar2_mem_io pf0_bar2_mem
set_component_parameter_value pf0_bar2_prefetch false
set_component_parameter_value pf0_bar2_start 0
set_component_parameter_value pf0_bar2_type pf0_bar2_mem32
set_component_parameter_value pf0_bar3_mem_io pf0_bar3_mem
set_component_parameter_value pf0_bar3_prefetch false
set_component_parameter_value pf0_bar3_start 0
set_component_parameter_value pf0_bar3_type pf0_bar3_mem32
set_component_parameter_value pf0_bar4_mem_io pf0_bar4_mem
set_component_parameter_value pf0_bar4_prefetch false
set_component_parameter_value pf0_bar4_start 0
set_component_parameter_value pf0_bar4_type pf0_bar4_mem32
set_component_parameter_value pf0_bar5_mem_io pf0_bar5_mem
set_component_parameter_value pf0_bar5_prefetch false
set_component_parameter_value pf0_bar5_start 0
set_component_parameter_value pf0_bar5_type pf0_bar5_mem32
set_component_parameter_value pf0_base_class_code 0
set_component_parameter_value pf0_cap_id_nxt_ptr_reg_rsvdp_20 false
set_component_parameter_value pf0_cap_pointer 64
set_component_parameter_value pf0_common_clk_n_fts 255
set_component_parameter_value pf0_con_status_reg_rsvdp_2 false
set_component_parameter_value pf0_con_status_reg_rsvdp_4 0
set_component_parameter_value pf0_config_phy_tx_change pf0_full_swing
set_component_parameter_value pf0_config_tx_comp_rx false
set_component_parameter_value pf0_cross_link_active false
set_component_parameter_value pf0_cross_link_en false
set_component_parameter_value pf0_d1_support pf0_d1_not_supported
set_component_parameter_value pf0_d2_support pf0_d2_not_supported
set_component_parameter_value pf0_dbi_reserved_0 0
set_component_parameter_value pf0_dbi_reserved_1 0
set_component_parameter_value pf0_dbi_reserved_10 0
set_component_parameter_value pf0_dbi_reserved_11 0
set_component_parameter_value pf0_dbi_reserved_12 0
set_component_parameter_value pf0_dbi_reserved_13 0
set_component_parameter_value pf0_dbi_reserved_14 0
set_component_parameter_value pf0_dbi_reserved_15 0
set_component_parameter_value pf0_dbi_reserved_16 0
set_component_parameter_value pf0_dbi_reserved_17 0
set_component_parameter_value pf0_dbi_reserved_18 0
set_component_parameter_value pf0_dbi_reserved_19 0
set_component_parameter_value pf0_dbi_reserved_2 0
set_component_parameter_value pf0_dbi_reserved_20 0
set_component_parameter_value pf0_dbi_reserved_21 0
set_component_parameter_value pf0_dbi_reserved_22 0
set_component_parameter_value pf0_dbi_reserved_23 0
set_component_parameter_value pf0_dbi_reserved_24 0
set_component_parameter_value pf0_dbi_reserved_25 0
set_component_parameter_value pf0_dbi_reserved_26 0
set_component_parameter_value pf0_dbi_reserved_27 0
set_component_parameter_value pf0_dbi_reserved_28 0
set_component_parameter_value pf0_dbi_reserved_29 0
set_component_parameter_value pf0_dbi_reserved_3 0
set_component_parameter_value pf0_dbi_reserved_30 0
set_component_parameter_value pf0_dbi_reserved_31 0
set_component_parameter_value pf0_dbi_reserved_32 0
set_component_parameter_value pf0_dbi_reserved_33 0
set_component_parameter_value pf0_dbi_reserved_34 0
set_component_parameter_value pf0_dbi_reserved_35 0
set_component_parameter_value pf0_dbi_reserved_36 0
set_component_parameter_value pf0_dbi_reserved_37 0
set_component_parameter_value pf0_dbi_reserved_38 0
set_component_parameter_value pf0_dbi_reserved_39 0
set_component_parameter_value pf0_dbi_reserved_4 0
set_component_parameter_value pf0_dbi_reserved_40 0
set_component_parameter_value pf0_dbi_reserved_41 0
set_component_parameter_value pf0_dbi_reserved_42 0
set_component_parameter_value pf0_dbi_reserved_43 0
set_component_parameter_value pf0_dbi_reserved_44 0
set_component_parameter_value pf0_dbi_reserved_45 0
set_component_parameter_value pf0_dbi_reserved_46 0
set_component_parameter_value pf0_dbi_reserved_47 0
set_component_parameter_value pf0_dbi_reserved_48 0
set_component_parameter_value pf0_dbi_reserved_49 0
set_component_parameter_value pf0_dbi_reserved_5 0
set_component_parameter_value pf0_dbi_reserved_50 0
set_component_parameter_value pf0_dbi_reserved_51 0
set_component_parameter_value pf0_dbi_reserved_52 0
set_component_parameter_value pf0_dbi_reserved_53 0
set_component_parameter_value pf0_dbi_reserved_54 0
set_component_parameter_value pf0_dbi_reserved_55 0
set_component_parameter_value pf0_dbi_reserved_56 0
set_component_parameter_value pf0_dbi_reserved_57 0
set_component_parameter_value pf0_dbi_reserved_6 0
set_component_parameter_value pf0_dbi_reserved_7 0
set_component_parameter_value pf0_dbi_reserved_8 0
set_component_parameter_value pf0_dbi_reserved_9 0
set_component_parameter_value pf0_dbi_ro_wr_en enable
set_component_parameter_value pf0_device_capabilities_reg_rsvdp_12 0
set_component_parameter_value pf0_device_capabilities_reg_rsvdp_16 0
set_component_parameter_value pf0_device_capabilities_reg_rsvdp_29 0
set_component_parameter_value pf0_direct_speed_change pf0_auto_speed_chg
set_component_parameter_value pf0_disable_fc_wd_timer enable
set_component_parameter_value pf0_disable_scrambler_gen_3 enable
set_component_parameter_value pf0_dll_link_en enable
set_component_parameter_value pf0_dsi pf0_not_required
set_component_parameter_value pf0_dsp_rx_preset_hint0 0
set_component_parameter_value pf0_dsp_rx_preset_hint1 0
set_component_parameter_value pf0_dsp_rx_preset_hint10 0
set_component_parameter_value pf0_dsp_rx_preset_hint11 0
set_component_parameter_value pf0_dsp_rx_preset_hint12 0
set_component_parameter_value pf0_dsp_rx_preset_hint13 0
set_component_parameter_value pf0_dsp_rx_preset_hint14 0
set_component_parameter_value pf0_dsp_rx_preset_hint15 0
set_component_parameter_value pf0_dsp_rx_preset_hint2 0
set_component_parameter_value pf0_dsp_rx_preset_hint3 0
set_component_parameter_value pf0_dsp_rx_preset_hint4 0
set_component_parameter_value pf0_dsp_rx_preset_hint5 0
set_component_parameter_value pf0_dsp_rx_preset_hint6 0
set_component_parameter_value pf0_dsp_rx_preset_hint7 0
set_component_parameter_value pf0_dsp_rx_preset_hint8 0
set_component_parameter_value pf0_dsp_rx_preset_hint9 0
set_component_parameter_value pf0_dsp_tx_preset0 0
set_component_parameter_value pf0_dsp_tx_preset1 0
set_component_parameter_value pf0_dsp_tx_preset10 0
set_component_parameter_value pf0_dsp_tx_preset11 0
set_component_parameter_value pf0_dsp_tx_preset12 0
set_component_parameter_value pf0_dsp_tx_preset13 0
set_component_parameter_value pf0_dsp_tx_preset14 0
set_component_parameter_value pf0_dsp_tx_preset15 0
set_component_parameter_value pf0_dsp_tx_preset2 0
set_component_parameter_value pf0_dsp_tx_preset3 0
set_component_parameter_value pf0_dsp_tx_preset4 0
set_component_parameter_value pf0_dsp_tx_preset5 0
set_component_parameter_value pf0_dsp_tx_preset6 0
set_component_parameter_value pf0_dsp_tx_preset7 0
set_component_parameter_value pf0_dsp_tx_preset8 0
set_component_parameter_value pf0_dsp_tx_preset9 0
set_component_parameter_value pf0_eidle_timer 0
set_component_parameter_value pf0_eq_eieos_cnt enable
set_component_parameter_value pf0_eq_phase_2_3 enable
set_component_parameter_value pf0_eq_redo enable
set_component_parameter_value pf0_exp_rom_bar_mask_reg_rsvdp_1 0
set_component_parameter_value pf0_exp_rom_base_addr_reg_rsvdp_1 0
set_component_parameter_value pf0_fast_link_mode false
set_component_parameter_value pf0_fast_training_seq 255
set_component_parameter_value pf0_forward_user_vsec false
set_component_parameter_value pf0_gen1_ei_inference pf0_use_rx_eidle
set_component_parameter_value pf0_gen2_ctrl_off_rsvdp_22 0
set_component_parameter_value pf0_gen3_dc_balance_disable enable
set_component_parameter_value pf0_gen3_dllp_xmt_delay_disable enable
set_component_parameter_value pf0_gen3_eq_control_off_rsvdp_26 0
set_component_parameter_value pf0_gen3_eq_control_off_rsvdp_6 0
set_component_parameter_value pf0_gen3_eq_eval_2ms_disable pf0_abort
set_component_parameter_value pf0_gen3_eq_fb_mode pf0_dir_chg
set_component_parameter_value pf0_gen3_eq_fb_mode_dir_change_off_rsvdp_18 0
set_component_parameter_value pf0_gen3_eq_fmdc_max_post_cusror_delta 2
set_component_parameter_value pf0_gen3_eq_fmdc_max_pre_cusror_delta 2
set_component_parameter_value pf0_gen3_eq_fmdc_n_evals 4
set_component_parameter_value pf0_gen3_eq_fmdc_t_min_phase23 2
set_component_parameter_value pf0_gen3_eq_fom_inc_initial_eval pf0_ignore_init_fom
set_component_parameter_value pf0_gen3_eq_local_fs 60
set_component_parameter_value pf0_gen3_eq_local_fs_lf_off_rsvdp_12 0
set_component_parameter_value pf0_gen3_eq_local_lf 20
set_component_parameter_value pf0_gen3_eq_phase23_exit_mode pf0_next_rec_speed
set_component_parameter_value pf0_gen3_eq_pset_req_as_coef false
set_component_parameter_value pf0_gen3_eq_pset_req_vec 256
set_component_parameter_value pf0_gen3_equalization_disable enable
set_component_parameter_value pf0_gen3_related_off_rsvdp_1 0
set_component_parameter_value pf0_gen3_related_off_rsvdp_13 0
set_component_parameter_value pf0_gen3_related_off_rsvdp_19 0
set_component_parameter_value pf0_gen3_zrxdc_noncompl pf0_compliant
set_component_parameter_value pf0_global_inval_spprtd false
set_component_parameter_value pf0_header_type 0
set_component_parameter_value pf0_int_pin pf0_inta
set_component_parameter_value pf0_invalidate_q_depth 0
set_component_parameter_value pf0_lane_equalization_control01_reg_rsvdp_15 false
set_component_parameter_value pf0_lane_equalization_control01_reg_rsvdp_23 false
set_component_parameter_value pf0_lane_equalization_control01_reg_rsvdp_31 false
set_component_parameter_value pf0_lane_equalization_control01_reg_rsvdp_7 false
set_component_parameter_value pf0_lane_equalization_control1011_reg_rsvdp_15 false
set_component_parameter_value pf0_lane_equalization_control1011_reg_rsvdp_23 false
